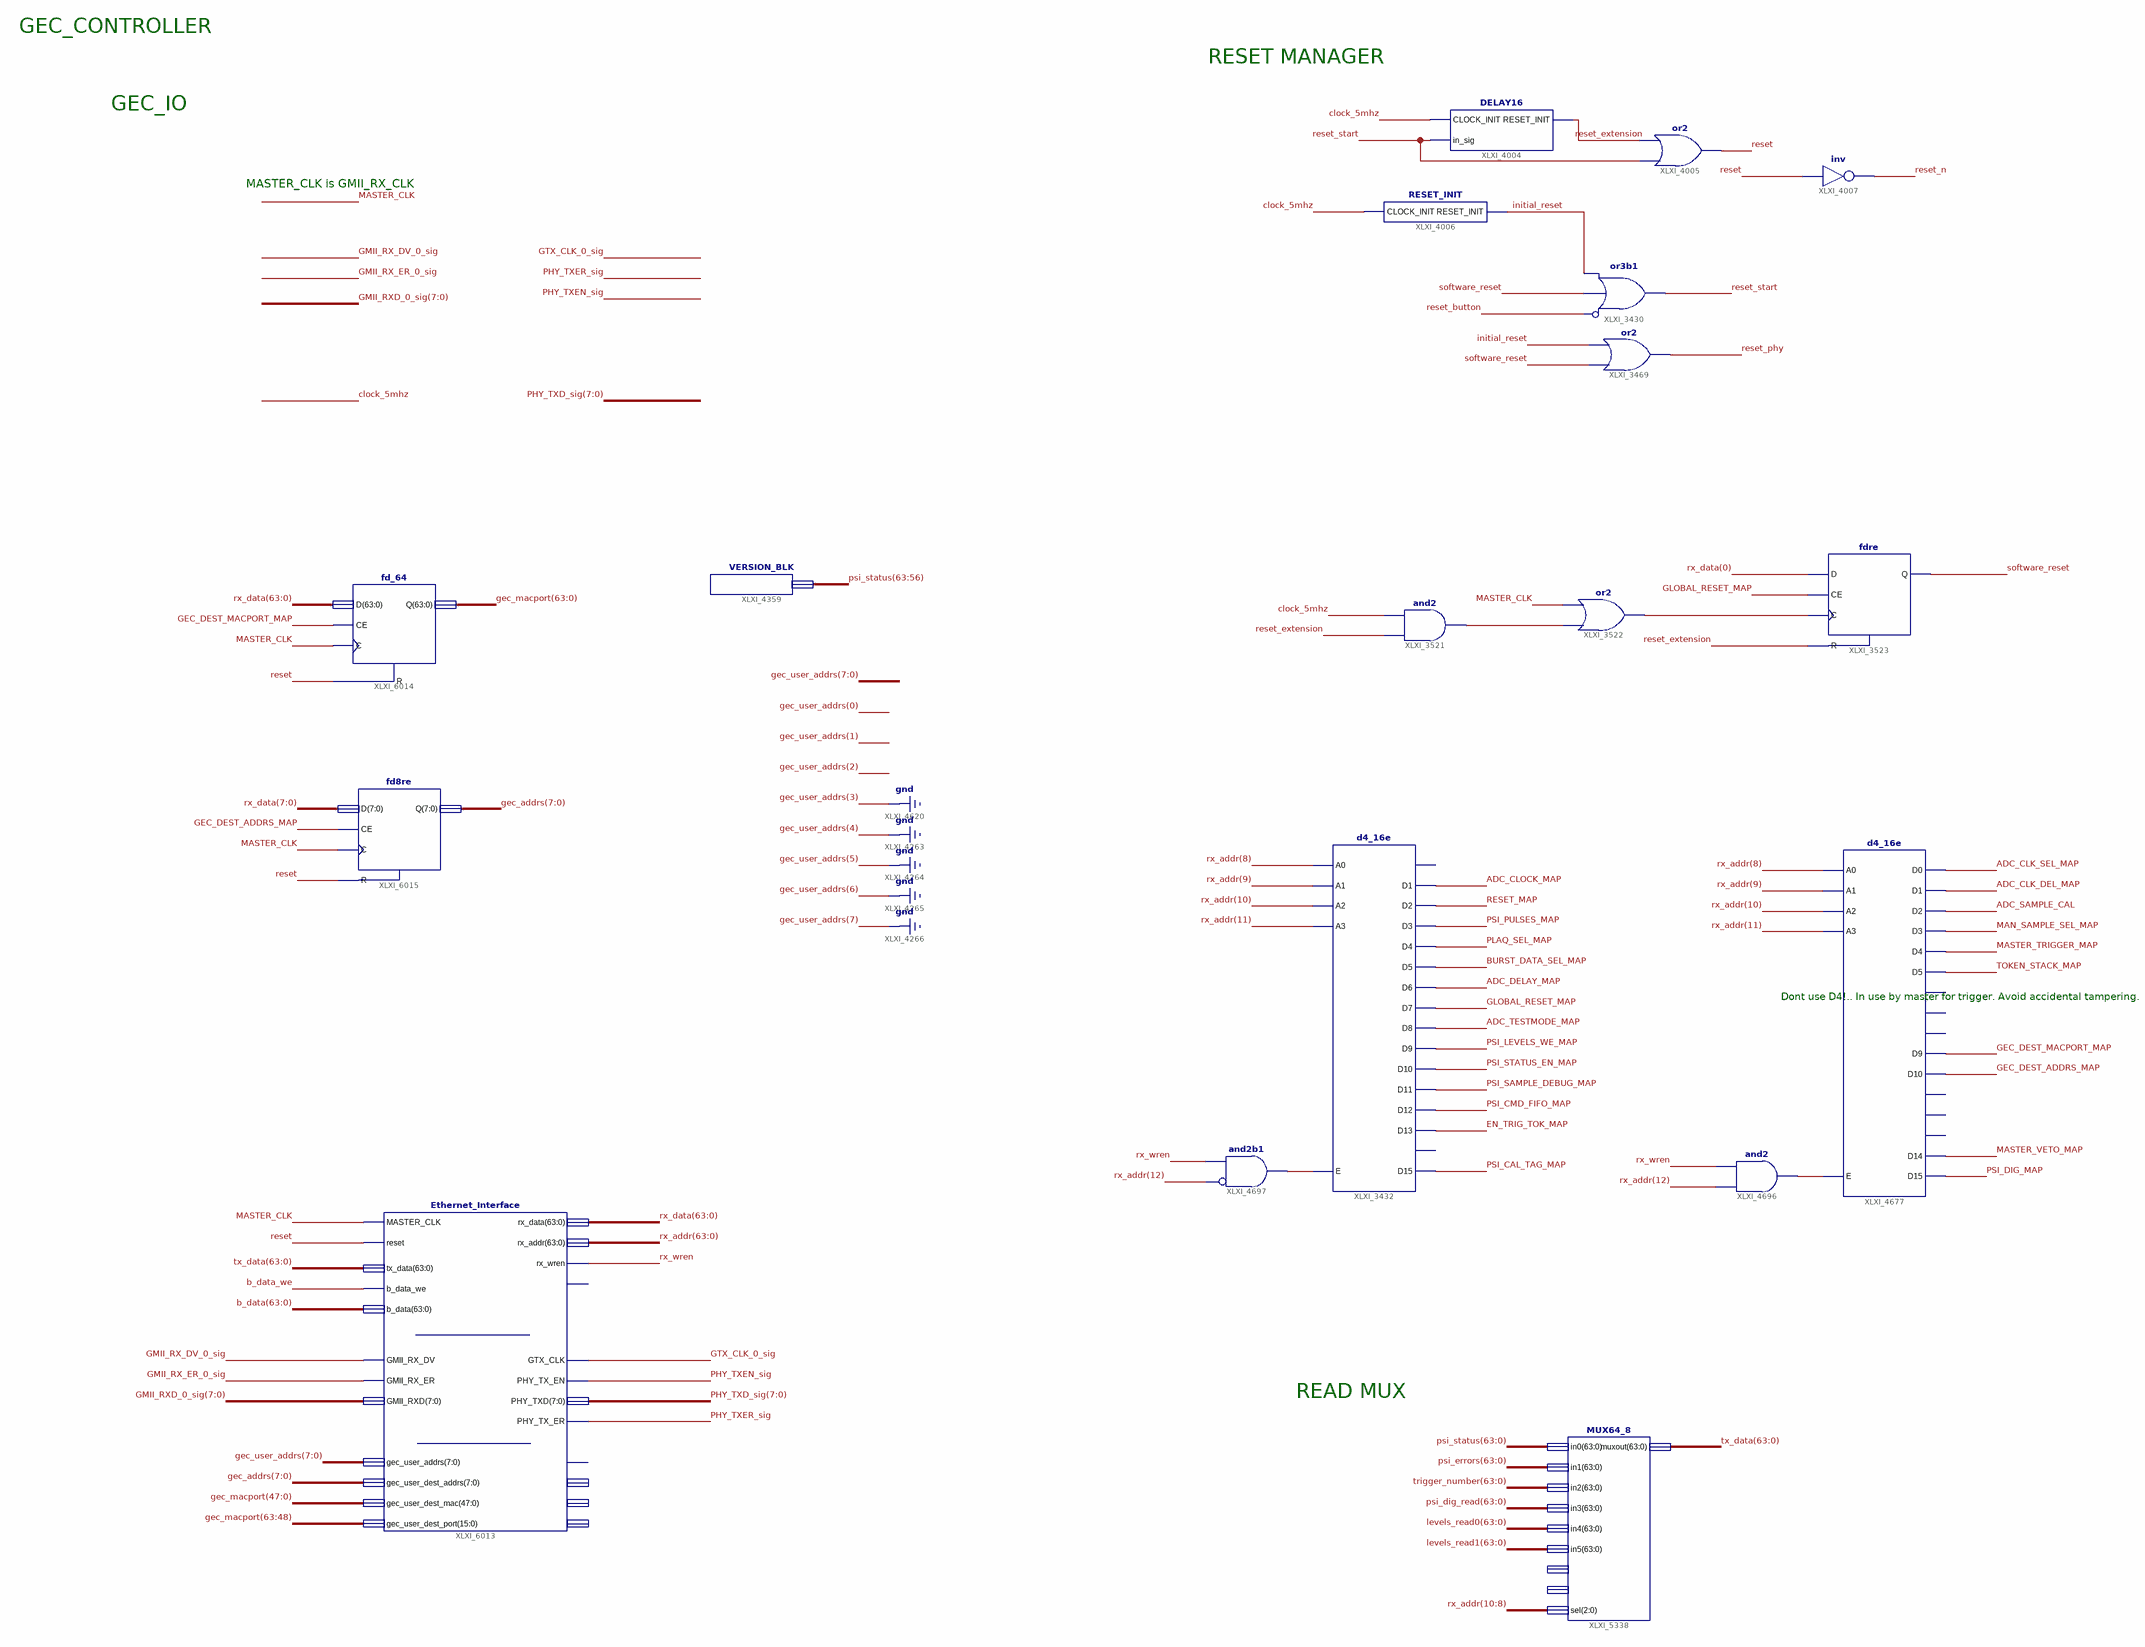
[diagram p0: schematic sheet 1]
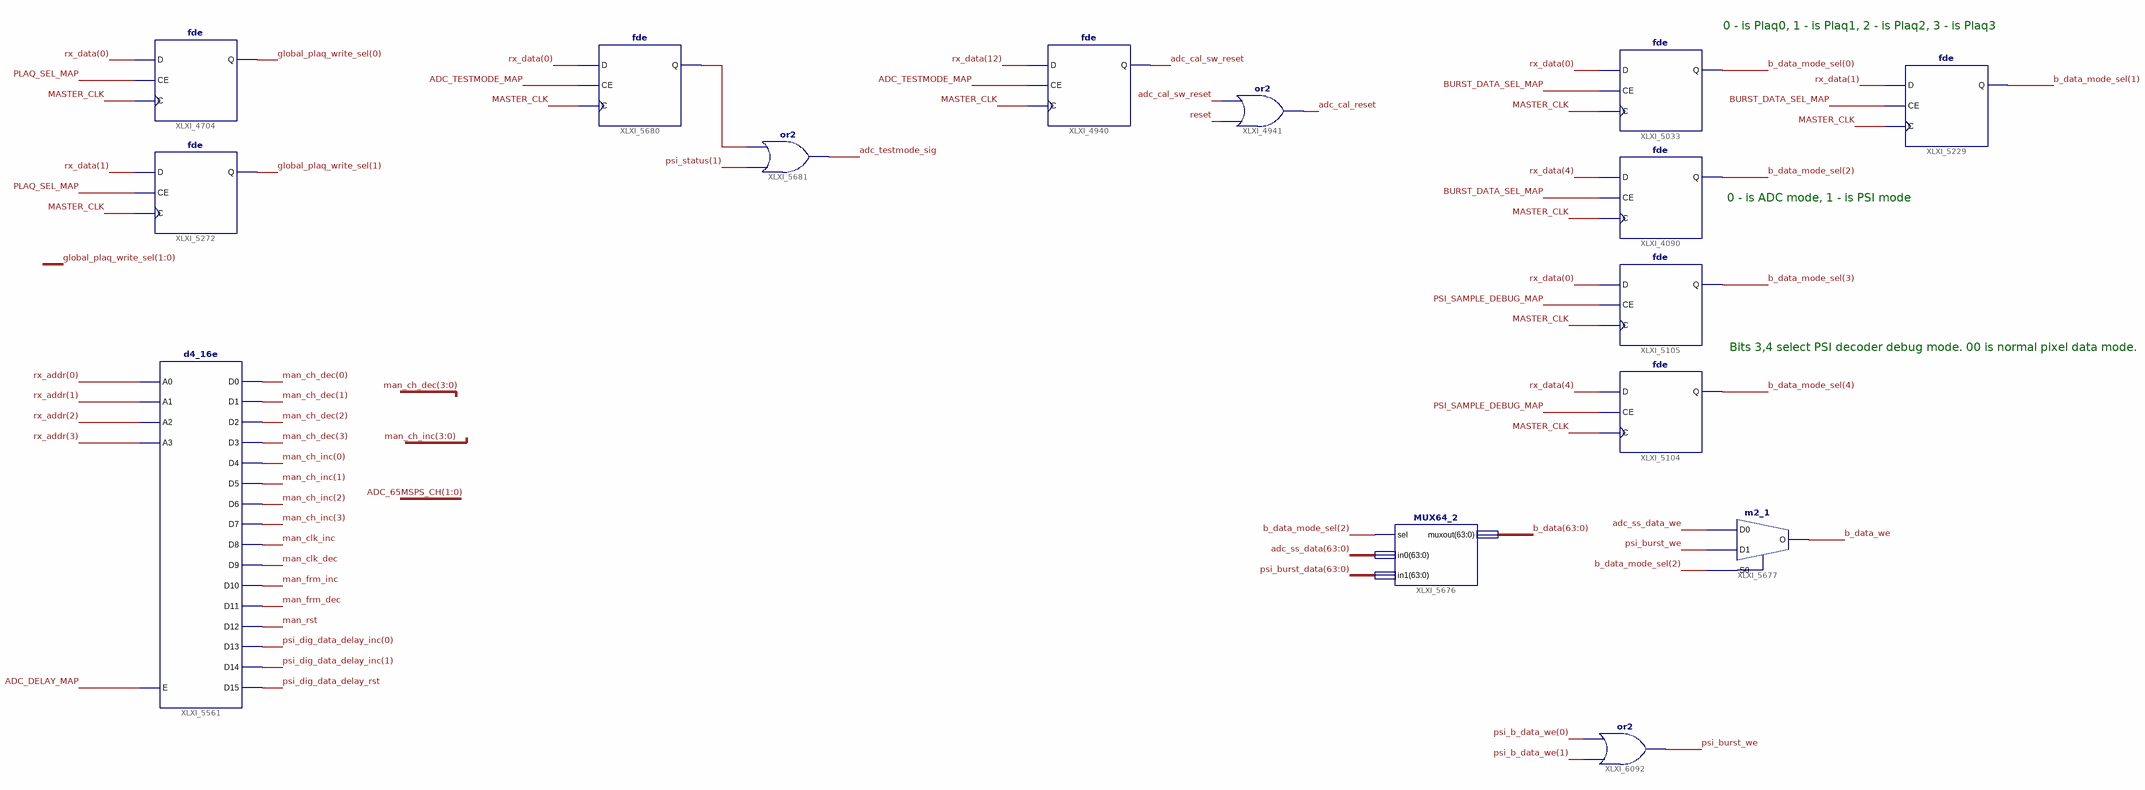
[diagram p1: schematic sheet 2]
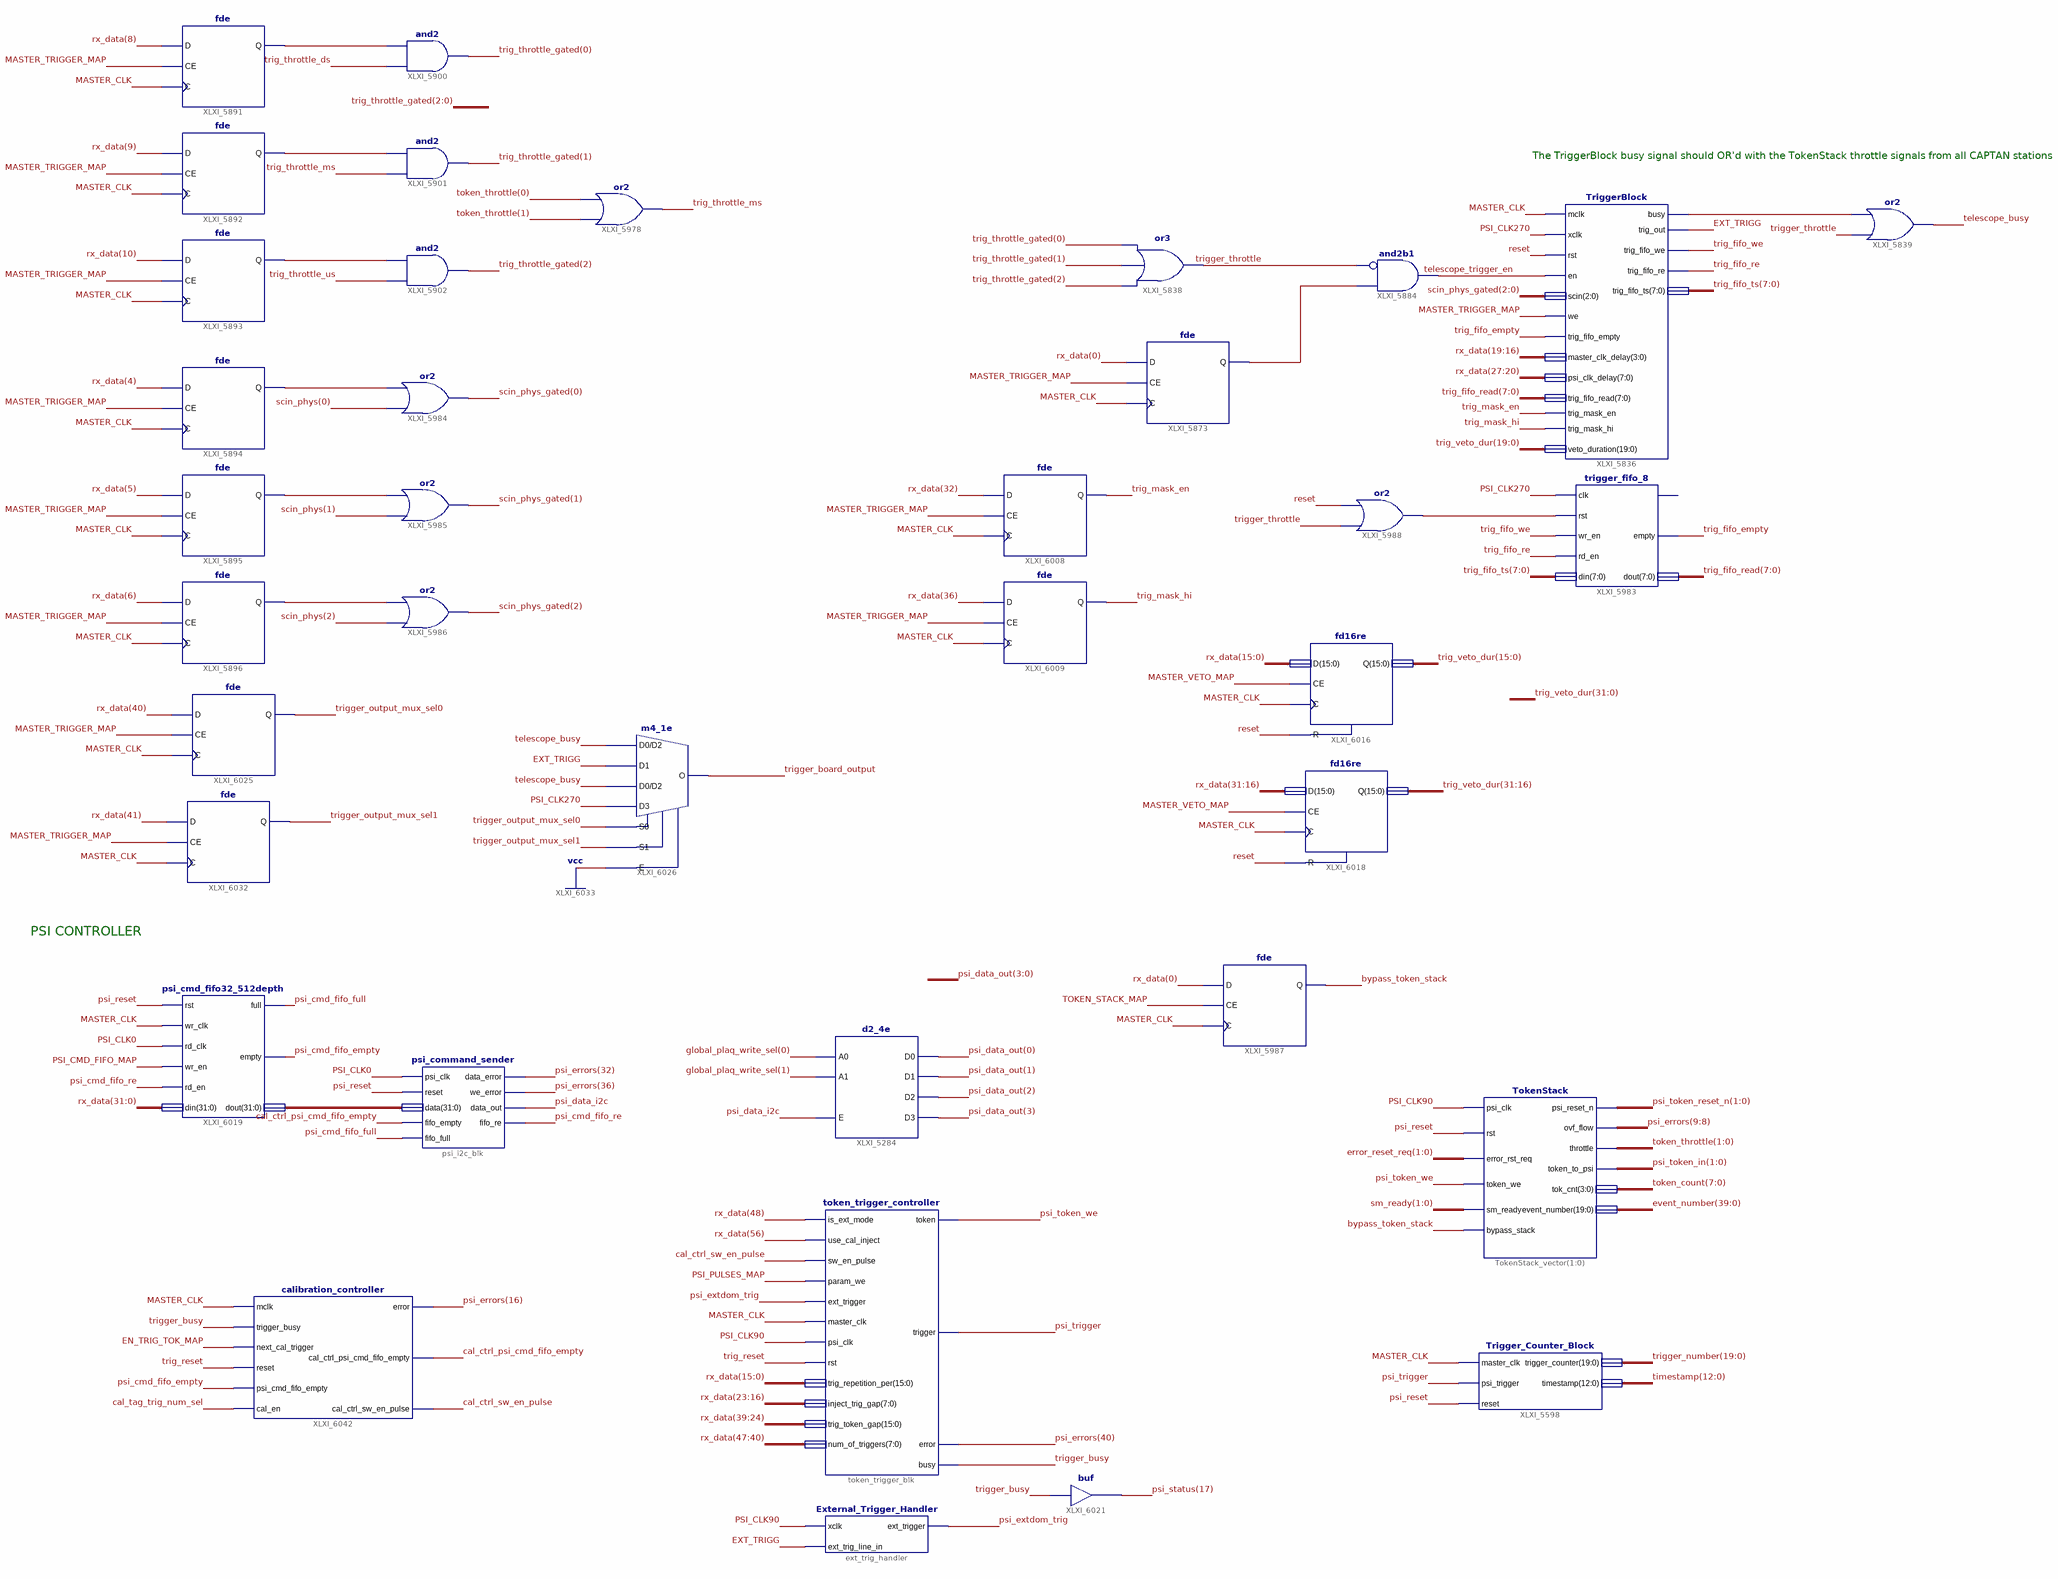
[diagram p2: schematic sheet 3]
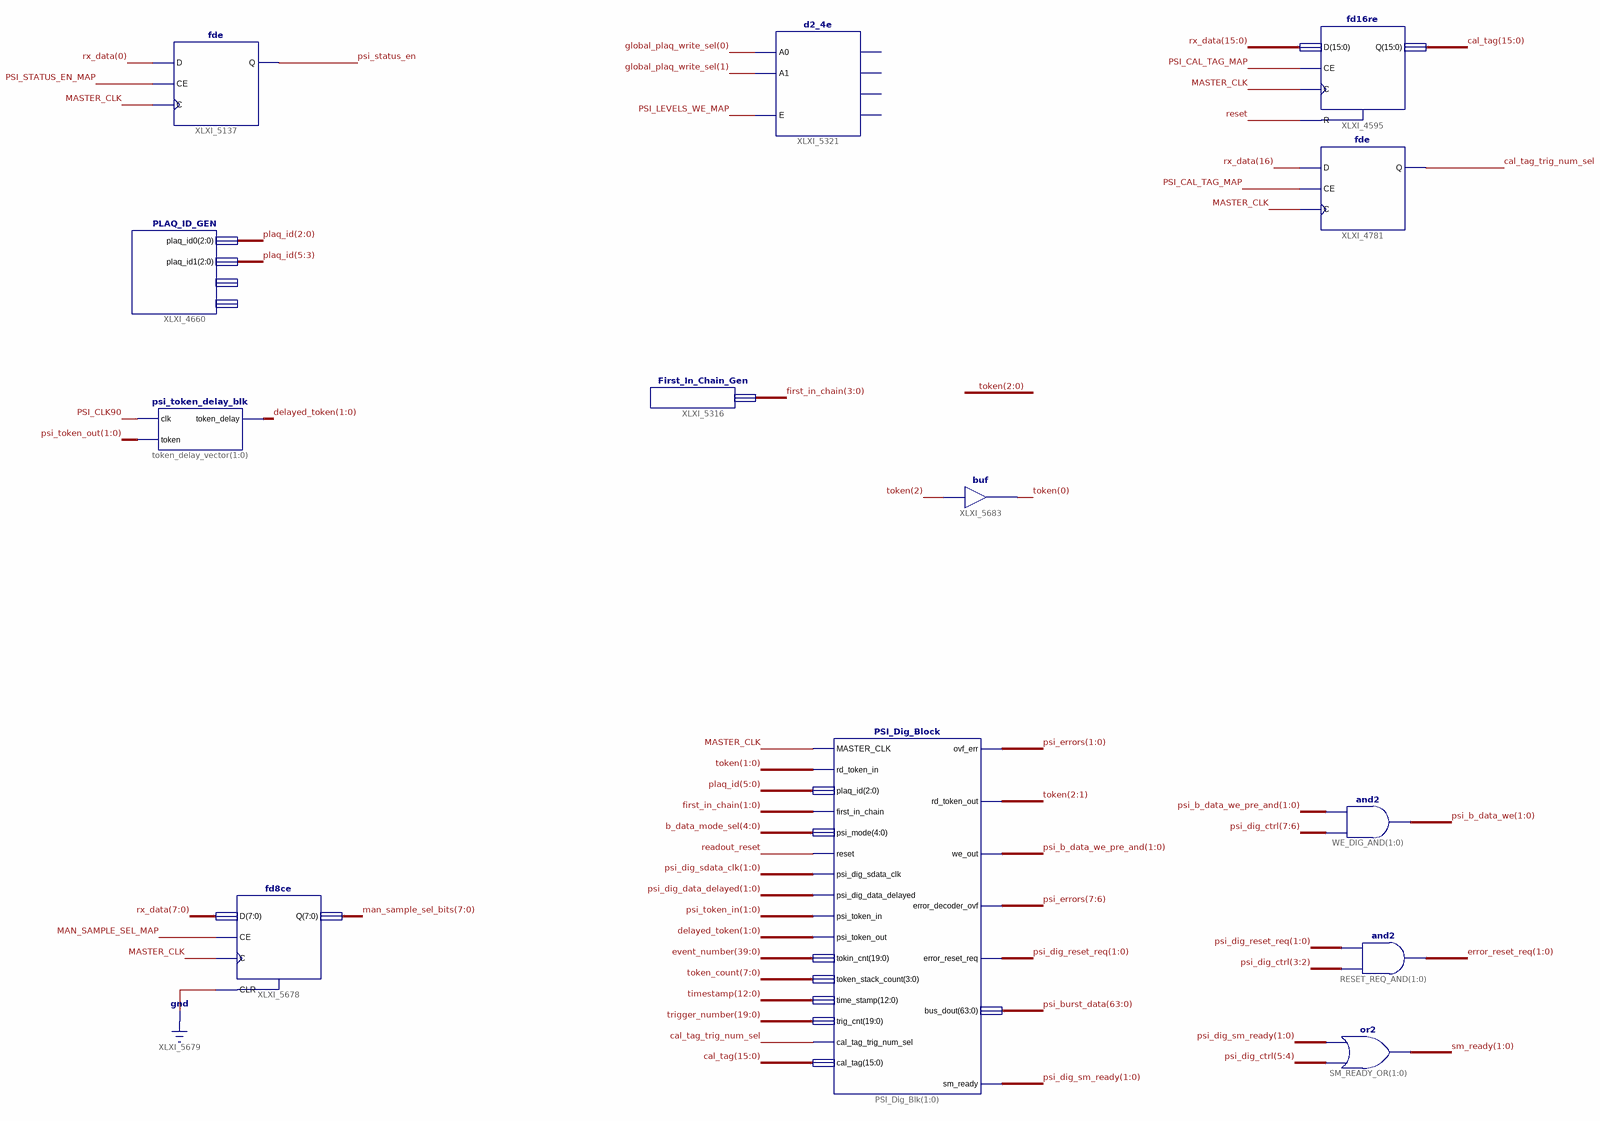
[diagram p3: schematic sheet 4]
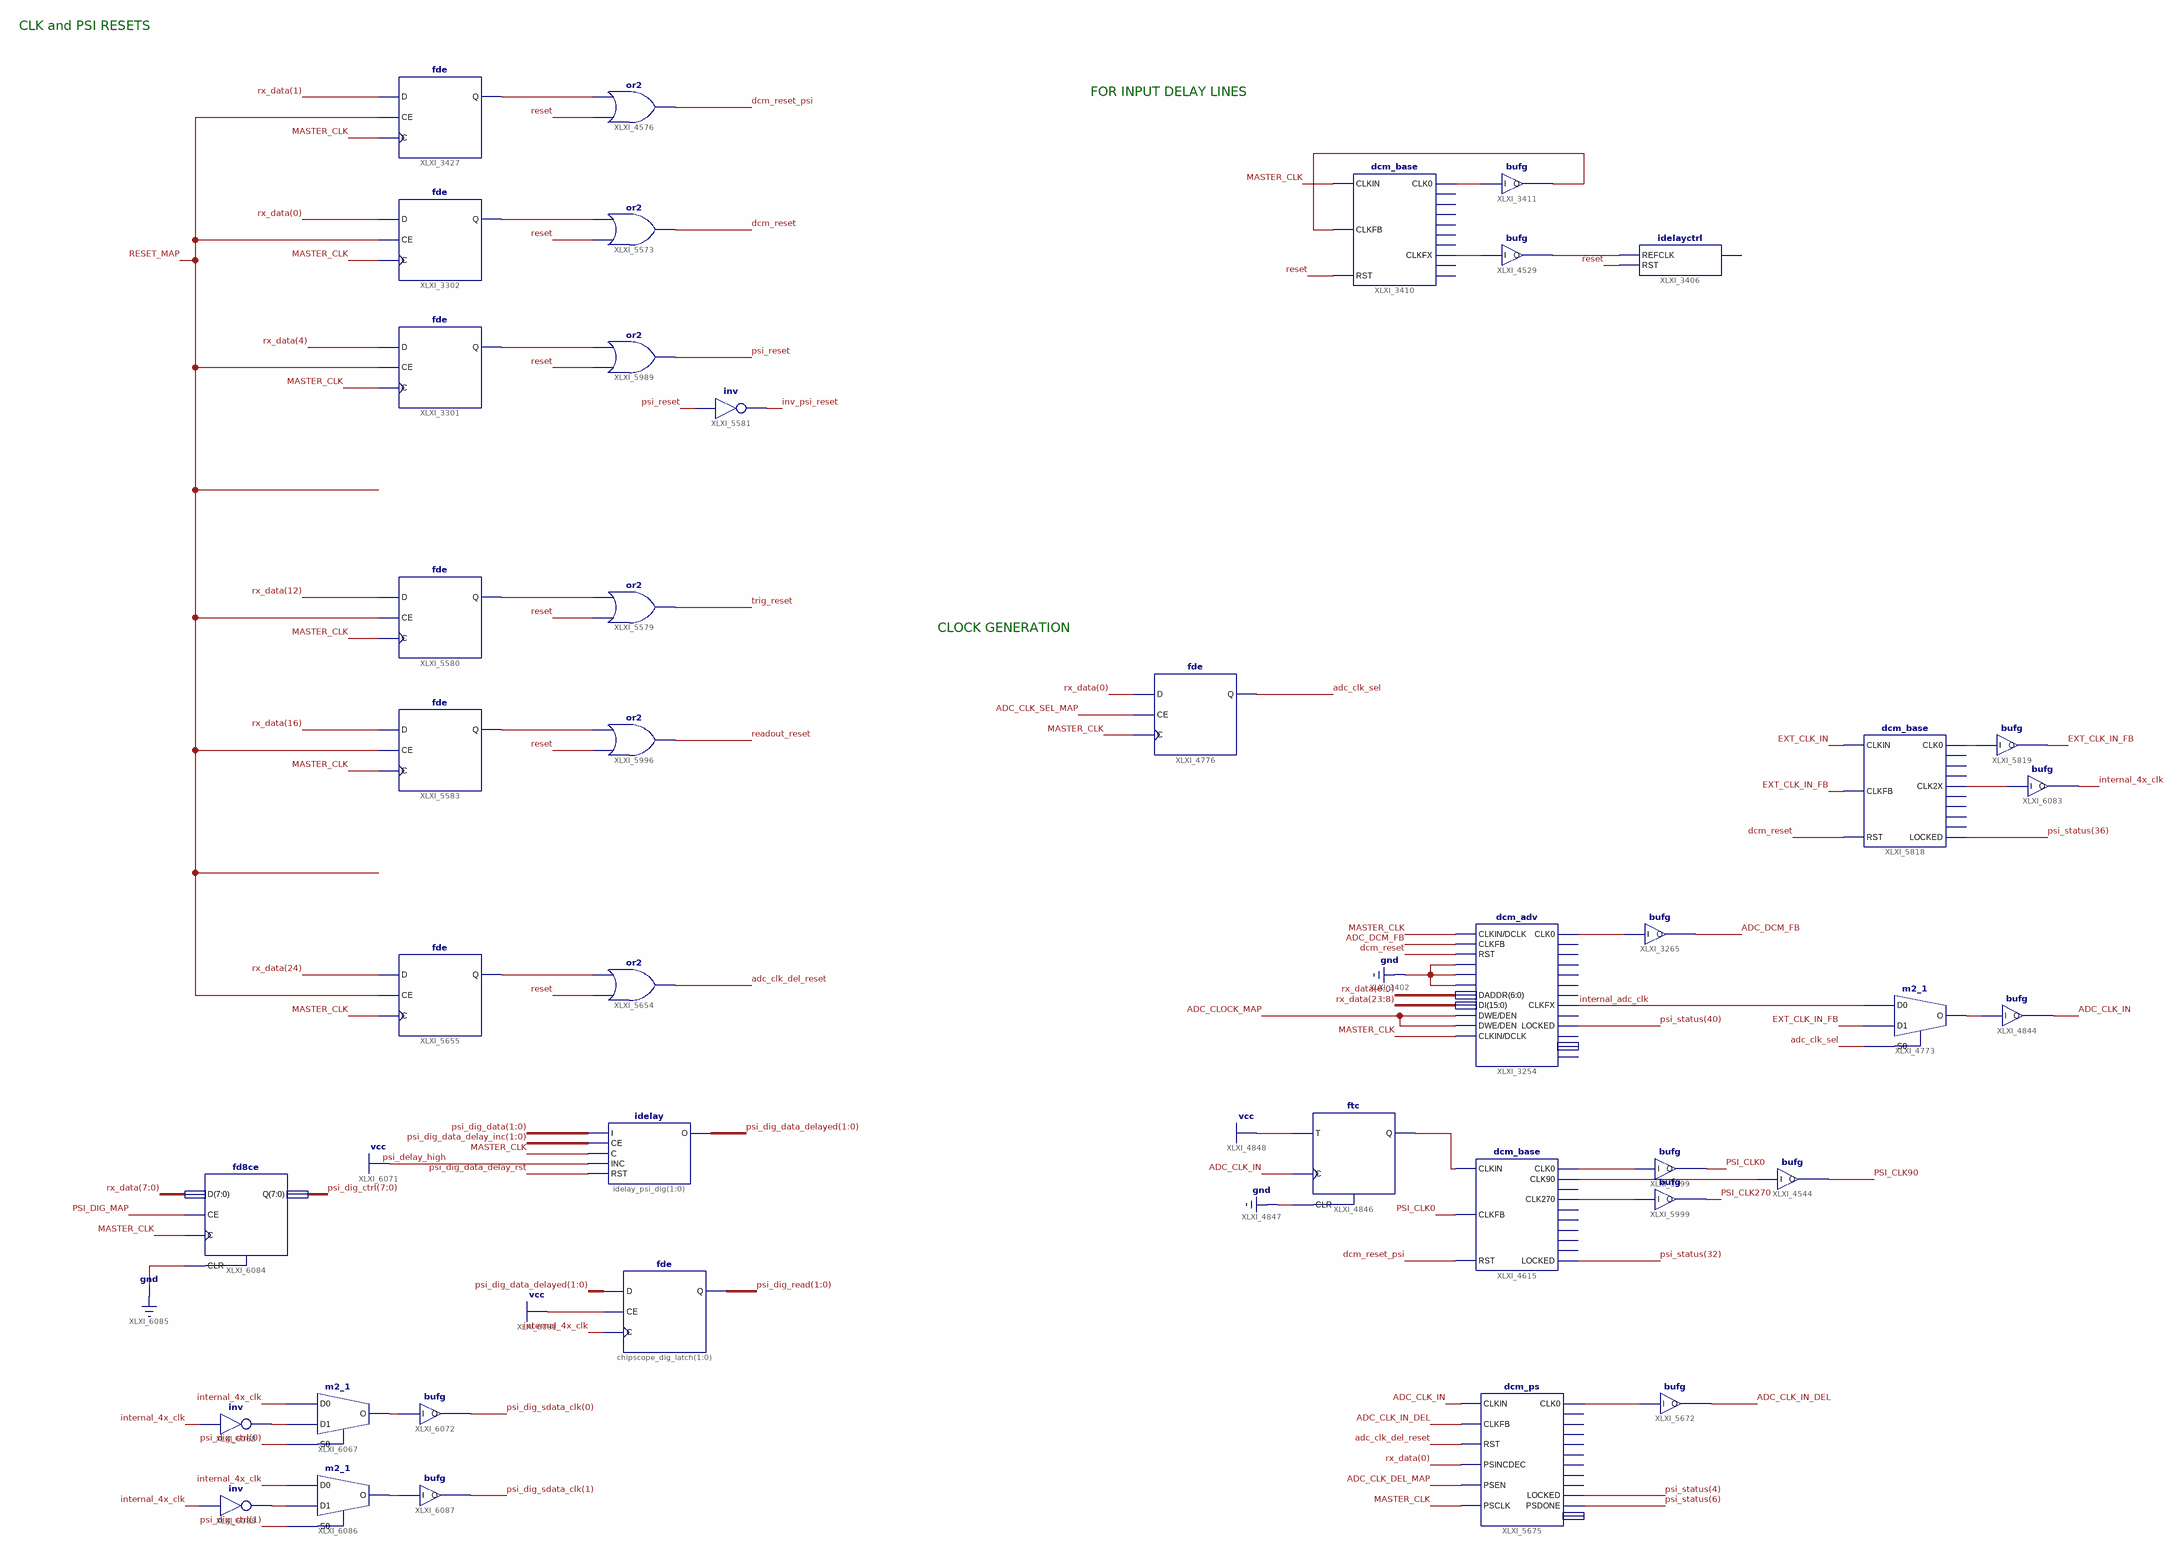
[diagram p4: schematic sheet 5]
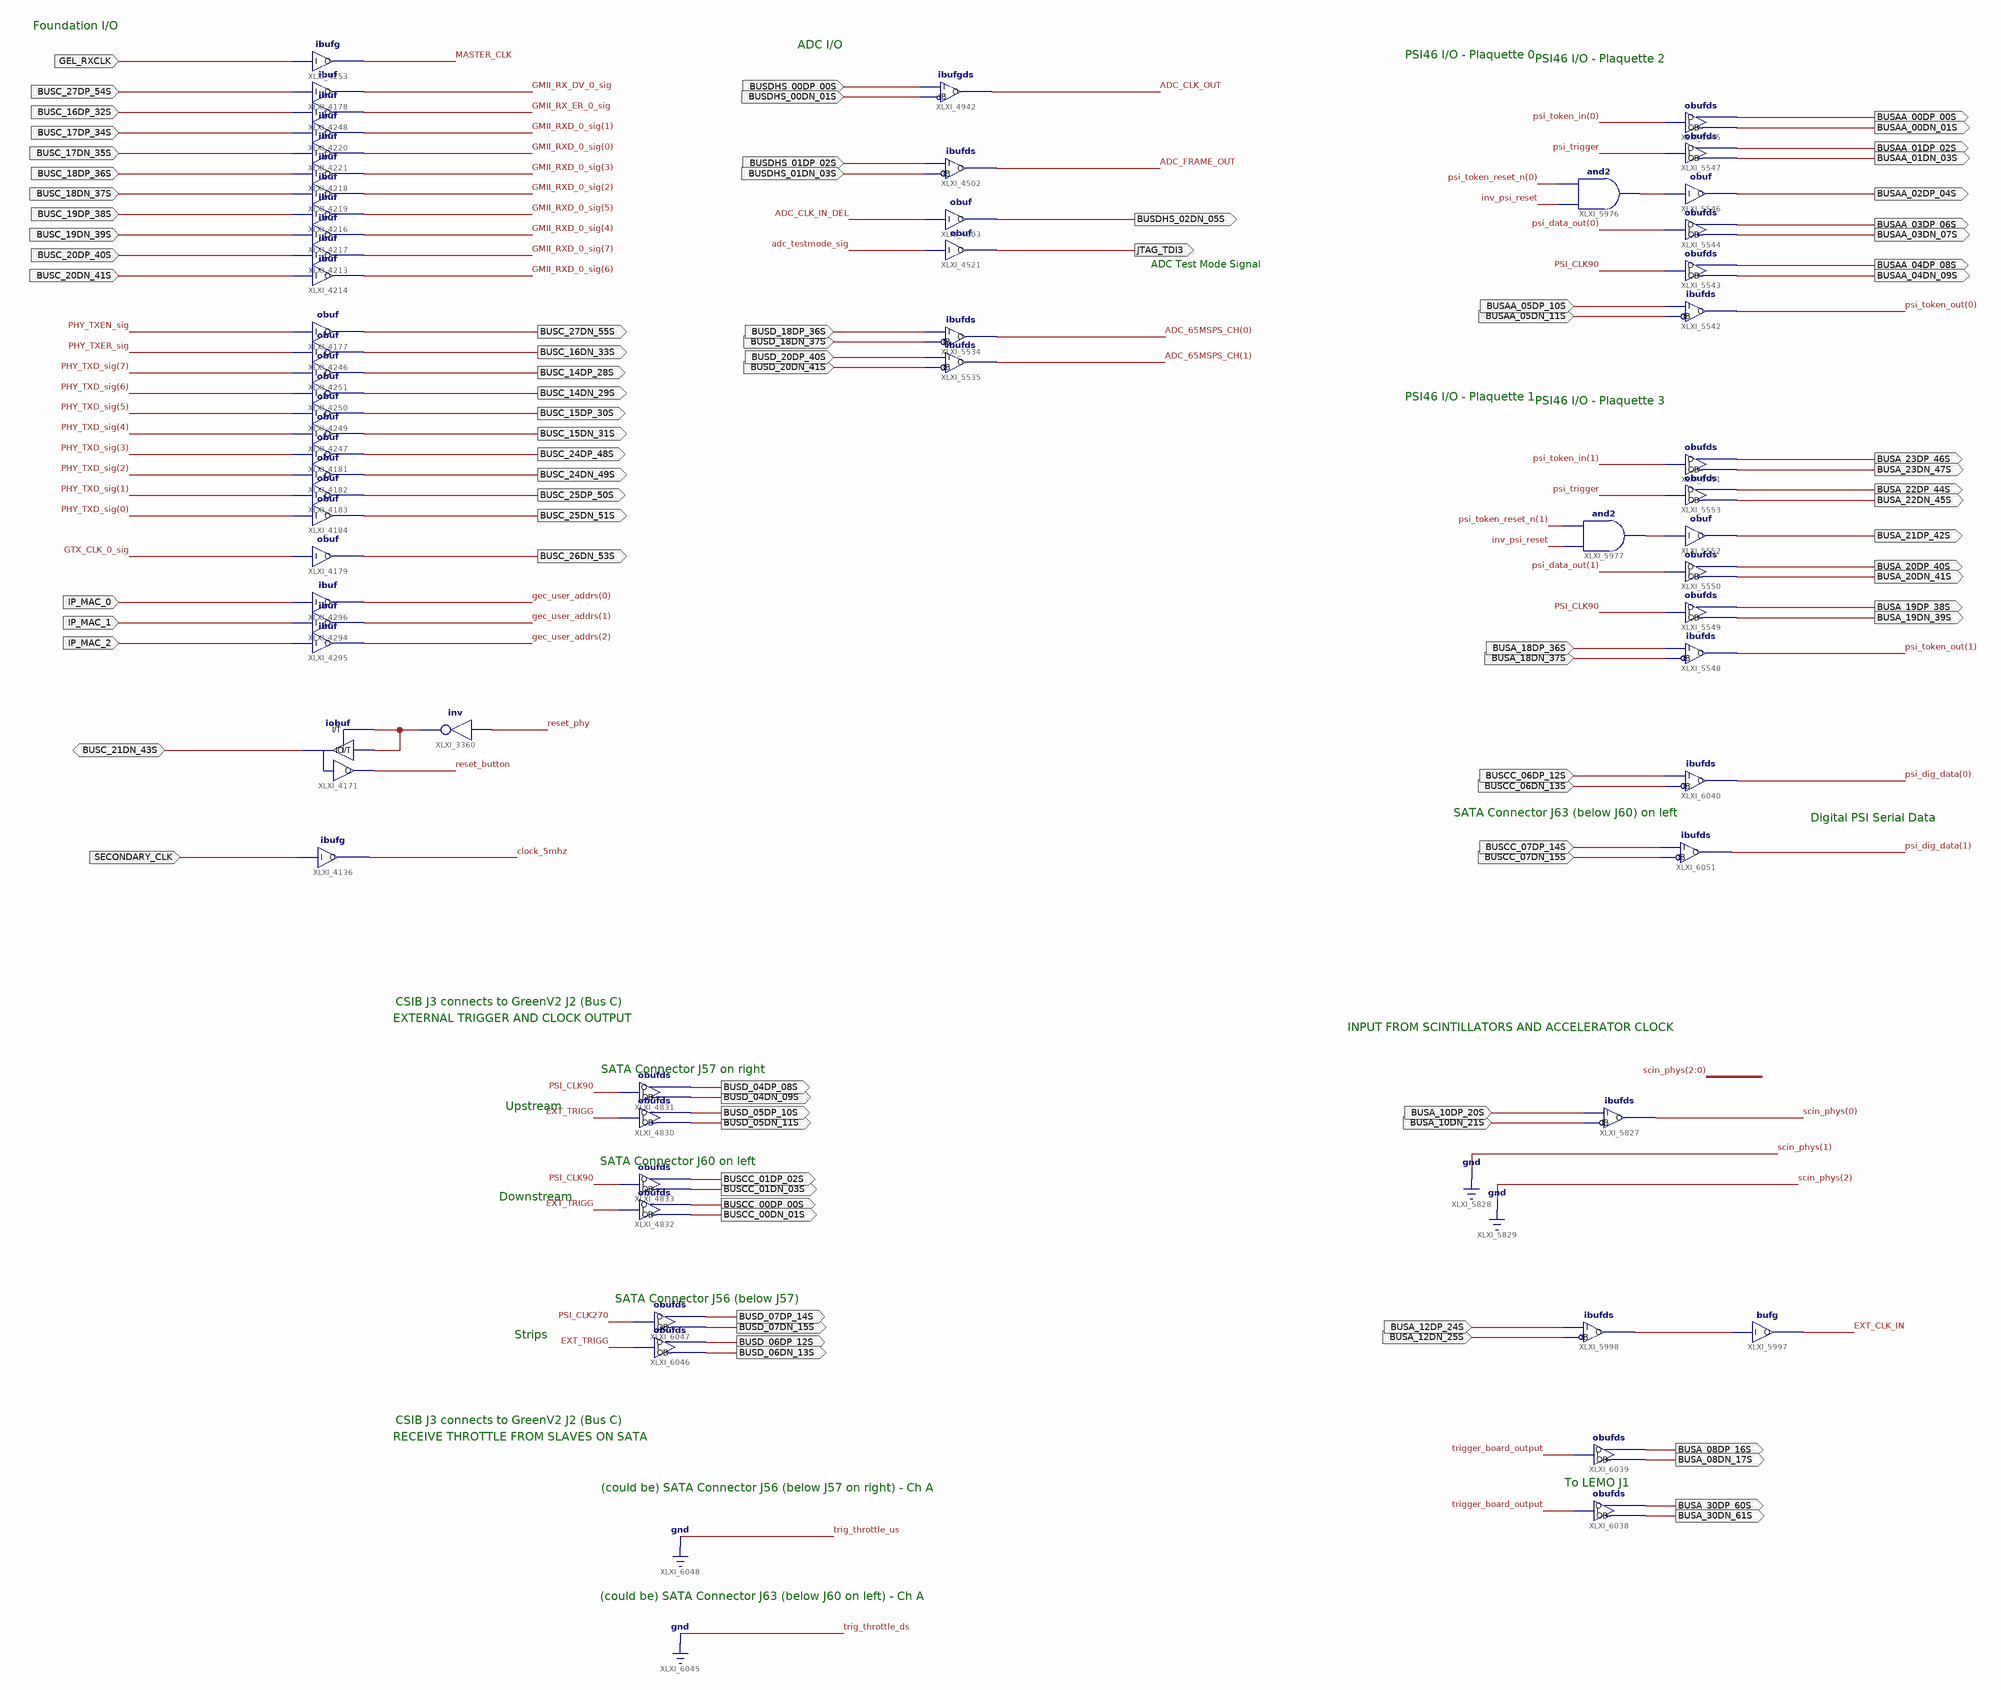
[diagram p5: schematic sheet 6]
// Xilinx ISE schematic TOP_LEVEL.sch (virtex4) as structural Verilog: 185 symbols, 83 ports
module TOP_LEVEL (
  input  BUSC_16DP_32S,
  input  SECONDARY_CLK,
  input  BUSC_20DN_41S,
  input  BUSC_19DN_39S,
  input  BUSC_20DP_40S,
  input  BUSC_19DP_38S,
  input  BUSC_18DP_36S,
  input  BUSC_18DN_37S,
  input  BUSC_17DN_35S,
  input  BUSC_17DP_34S,
  input  BUSC_27DP_54S,
  input  GEL_RXCLK,
  input  IP_MAC_2,
  input  IP_MAC_0,
  input  IP_MAC_1,
  input  BUSDHS_00DP_00S,
  input  BUSDHS_00DN_01S,
  input  BUSDHS_01DP_02S,
  input  BUSDHS_01DN_03S,
  input  BUSD_18DN_37S,
  input  BUSD_18DP_36S,
  input  BUSD_20DN_41S,
  input  BUSD_20DP_40S,
  input  BUSAA_05DP_10S,
  input  BUSAA_05DN_11S,
  input  BUSA_18DP_36S,
  input  BUSA_18DN_37S,
  input  BUSA_12DP_24S,
  input  BUSA_12DN_25S,
  input  BUSA_10DP_20S,
  input  BUSA_10DN_21S,
  input  BUSCC_07DN_15S,
  input  BUSCC_07DP_14S,
  input  BUSCC_06DP_12S,
  input  BUSCC_06DN_13S,
  inout  BUSC_21DN_43S,
  output BUSC_25DN_51S,
  output BUSC_25DP_50S,
  output BUSC_24DN_49S,
  output BUSC_24DP_48S,
  output BUSC_15DN_31S,
  output BUSC_15DP_30S,
  output BUSC_14DN_29S,
  output BUSC_14DP_28S,
  output BUSC_16DN_33S,
  output BUSC_27DN_55S,
  output BUSC_26DN_53S,
  output BUSDHS_02DN_05S,
  output JTAG_TDI3,
  output BUSAA_04DP_08S,
  output BUSAA_04DN_09S,
  output BUSAA_03DP_06S,
  output BUSAA_03DN_07S,
  output BUSAA_00DP_00S,
  output BUSAA_00DN_01S,
  output BUSAA_02DP_04S,
  output BUSAA_01DP_02S,
  output BUSAA_01DN_03S,
  output BUSA_19DP_38S,
  output BUSA_19DN_39S,
  output BUSA_20DP_40S,
  output BUSA_20DN_41S,
  output BUSA_23DP_46S,
  output BUSA_23DN_47S,
  output BUSA_21DP_42S,
  output BUSA_22DP_44S,
  output BUSA_22DN_45S,
  output BUSD_04DN_09S,
  output BUSD_04DP_08S,
  output BUSCC_00DP_00S,
  output BUSCC_00DN_01S,
  output BUSD_05DN_11S,
  output BUSD_05DP_10S,
  output BUSCC_01DN_03S,
  output BUSCC_01DP_02S,
  output BUSA_08DP_16S,
  output BUSA_30DP_60S,
  output BUSA_30DN_61S,
  output BUSA_08DN_17S,
  output BUSD_07DP_14S,
  output BUSD_07DN_15S,
  output BUSD_06DN_13S,
  output BUSD_06DP_12S
);

  wire adc_cal_reset, adc_cal_sw_reset, ADC_CLK_DEL_MAP, adc_clk_del_reset, ADC_CLK_IN, ADC_CLK_IN_DEL,
       ADC_CLK_OUT, adc_clk_sel, ADC_CLK_SEL_MAP, ADC_CLOCK_MAP, ADC_DCM_FB, ADC_DELAY_MAP, ADC_FRAME_OUT,
       ADC_SAMPLE_CAL, adc_ss_data_we, ADC_TESTMODE_MAP, adc_testmode_sig, b_data_we, BURST_DATA_SEL_MAP,
       bypass_token_stack, cal_ctrl_psi_cmd_fifo_empty, cal_ctrl_sw_en_pulse, cal_tag_trig_num_sel,
       clock_5mhz, dcm_reset, dcm_reset_psi, EN_TRIG_TOK_MAP, EXT_CLK_IN, EXT_CLK_IN_FB, EXT_TRIGG,
       GEC_DEST_ADDRS_MAP, GEC_DEST_MACPORT_MAP, GLOBAL_RESET_MAP, GMII_RX_DV_0_sig, GMII_RX_ER_0_sig,
       GTX_CLK_0_sig, initial_reset, internal_4x_clk, internal_adc_clk, inv_psi_reset, man_clk_dec,
       man_clk_inc, man_frm_dec, man_frm_inc, man_rst, MAN_SAMPLE_SEL_MAP, MASTER_CLK, MASTER_TRIGGER_MAP,
       MASTER_VETO_MAP, PHY_TXEN_sig, PHY_TXER_sig, PLAQ_SEL_MAP, psi_burst_we, PSI_CAL_TAG_MAP, PSI_CLK0,
       PSI_CLK90, PSI_CLK270, psi_cmd_fifo_empty, psi_cmd_fifo_full, PSI_CMD_FIFO_MAP, psi_cmd_fifo_re,
       psi_data_i2c, psi_dig_data_delay_rst, PSI_DIG_MAP, psi_extdom_trig, PSI_LEVELS_WE_MAP, PSI_PULSES_MAP,
       psi_reset, PSI_SAMPLE_DEBUG_MAP, psi_status_en, PSI_STATUS_EN_MAP, psi_token_we, psi_trigger,
       readout_reset, reset, reset_button, reset_extension, RESET_MAP, reset_n, reset_phy, reset_start,
       rx_wren, software_reset, telescope_busy, telescope_trigger_en, TOKEN_STACK_MAP, trig_fifo_empty,
       trig_fifo_re, trig_fifo_we, trig_mask_en, trig_mask_hi, trig_reset, trig_throttle_ms,
       trigger_board_output, trigger_busy, trigger_output_mux_sel0, trigger_output_mux_sel1,
       trigger_throttle, XLXN_11574, XLXN_12023, XLXN_12172, XLXN_12220, XLXN_12229, XLXN_12257, XLXN_12498,
       XLXN_12503, XLXN_12617, XLXN_15064, XLXN_15111, XLXN_15755, XLXN_15843, XLXN_15849, XLXN_17193,
       XLXN_17196, XLXN_17199, XLXN_17233, XLXN_17239, XLXN_17430, XLXN_17510, XLXN_17527, XLXN_17712,
       XLXN_17722, XLXN_17849, XLXN_17913, XLXN_17914, XLXN_17915, XLXN_17999, XLXN_18000, XLXN_18001,
       XLXN_18123, XLXN_18124, XLXN_18128, XLXN_18141, XLXN_18142, XLXN_18354, XLXN_18355, XLXN_18356,
       XLXN_18372, XLXN_18373;
  wire [0:0] scin_phys;
  wire [1:0] ADC_65MSPS_CH, delayed_token, error_reset_req, global_plaq_write_sel, psi_b_data_we,
       psi_b_data_we_pre_and, psi_dig_data, psi_dig_data_delay_inc, psi_dig_data_delayed, psi_dig_reset_req,
       psi_dig_sdata_clk, psi_dig_sm_ready, psi_token_in, psi_token_out, psi_token_reset_n, sm_ready,
       token_throttle;
  wire [2:0] gec_user_addrs, scin_phys_gated, token, trig_throttle_gated;
  wire [3:0] first_in_chain, man_ch_dec, man_ch_inc, psi_data_out;
  wire [4:0] b_data_mode_sel;
  wire [5:0] plaq_id;
  wire [7:0] gec_addrs, GMII_RXD_0_sig, man_sample_sel_bits, PHY_TXD_sig, psi_dig_ctrl, token_count,
       trig_fifo_read, trig_fifo_ts;
  wire [12:0] timestamp;
  wire [15:0] cal_tag;
  wire [31:0] trig_veto_dur, XLXN_16082;
  wire [39:0] event_number;
  wire [63:0] adc_ss_data, b_data, gec_macport, levels_read0, levels_read1, psi_burst_data, psi_dig_read,
       psi_errors, psi_status, rx_addr, rx_data, trigger_number, tx_data;

  iobuf XLXI_4171 (.I(XLXN_12023), .IO(BUSC_21DN_43S), .O(reset_button), .T(XLXN_12023));
  not XLXI_3360 (XLXN_12023, reset_phy);
  ibuf XLXI_4248 (.I(BUSC_16DP_32S), .O(GMII_RX_ER_0_sig));
  ibufg XLXI_4136 (.I(SECONDARY_CLK), .O(clock_5mhz));
  obuf XLXI_4181 (.I(PHY_TXD_sig[3]), .O(BUSC_24DP_48S));
  obuf XLXI_4182 (.I(PHY_TXD_sig[2]), .O(BUSC_24DN_49S));
  obuf XLXI_4183 (.I(PHY_TXD_sig[1]), .O(BUSC_25DP_50S));
  obuf XLXI_4184 (.I(PHY_TXD_sig[0]), .O(BUSC_25DN_51S));
  obuf XLXI_4247 (.I(PHY_TXD_sig[4]), .O(BUSC_15DN_31S));
  obuf XLXI_4249 (.I(PHY_TXD_sig[5]), .O(BUSC_15DP_30S));
  obuf XLXI_4250 (.I(PHY_TXD_sig[6]), .O(BUSC_14DN_29S));
  obuf XLXI_4251 (.I(PHY_TXD_sig[7]), .O(BUSC_14DP_28S));
  obuf XLXI_4246 (.I(PHY_TXER_sig), .O(BUSC_16DN_33S));
  ibuf XLXI_4213 (.I(BUSC_20DP_40S), .O(GMII_RXD_0_sig[7]));
  ibuf XLXI_4214 (.I(BUSC_20DN_41S), .O(GMII_RXD_0_sig[6]));
  ibuf XLXI_4216 (.I(BUSC_19DP_38S), .O(GMII_RXD_0_sig[5]));
  ibuf XLXI_4217 (.I(BUSC_19DN_39S), .O(GMII_RXD_0_sig[4]));
  ibuf XLXI_4218 (.I(BUSC_18DP_36S), .O(GMII_RXD_0_sig[3]));
  ibuf XLXI_4219 (.I(BUSC_18DN_37S), .O(GMII_RXD_0_sig[2]));
  ibuf XLXI_4220 (.I(BUSC_17DP_34S), .O(GMII_RXD_0_sig[1]));
  ibuf XLXI_4221 (.I(BUSC_17DN_35S), .O(GMII_RXD_0_sig[0]));
  obuf XLXI_4177 (.I(PHY_TXEN_sig), .O(BUSC_27DN_55S));
  ibuf XLXI_4178 (.I(BUSC_27DP_54S), .O(GMII_RX_DV_0_sig));
  ibufg XLXI_4253 (.I(GEL_RXCLK), .O(MASTER_CLK));
  obuf XLXI_4179 (.I(GTX_CLK_0_sig), .O(BUSC_26DN_53S));
  ibuf XLXI_4294 (.I(IP_MAC_1), .O(gec_user_addrs[1]));
  ibuf XLXI_4295 (.I(IP_MAC_2), .O(gec_user_addrs[2]));
  ibuf XLXI_4296 (.I(IP_MAC_0), .O(gec_user_addrs[0]));
  ibufds #(.DIFF_TERM("TRUE")) XLXI_4502 (.I(BUSDHS_01DP_02S), .IB(BUSDHS_01DN_03S), .O(ADC_FRAME_OUT));
  obuf XLXI_4503 (.I(ADC_CLK_IN_DEL), .O(BUSDHS_02DN_05S));
  RESET_INIT XLXI_4006 (.CLOCK_INIT(clock_5mhz), .RESET_INIT(initial_reset));
  or XLXI_3430 (reset_start, ~reset_button, software_reset, initial_reset);  // or3b1
  or XLXI_3469 (reset_phy, software_reset, initial_reset);
  DELAY16 XLXI_4004 (.CLOCK_INIT(clock_5mhz), .in_sig(reset_start), .RESET_INIT(reset_extension));
  or XLXI_4005 (reset, reset_start, reset_extension);
  fdre XLXI_3523 (.C(XLXN_12498), .CE(GLOBAL_RESET_MAP), .D(rx_data[0]), .R(reset_extension), .Q(software_reset));
  and XLXI_3521 (XLXN_12503, reset_extension, clock_5mhz);
  or XLXI_3522 (XLXN_12498, XLXN_12503, MASTER_CLK);
  d4_16e XLXI_3432 (
    .A0(rx_addr[8]), .A1(rx_addr[9]), .A2(rx_addr[10]), .A3(rx_addr[11]), .E(XLXN_12617), .D1(ADC_CLOCK_MAP),
    .D10(PSI_STATUS_EN_MAP), .D11(PSI_SAMPLE_DEBUG_MAP), .D12(PSI_CMD_FIFO_MAP), .D13(EN_TRIG_TOK_MAP),
    .D15(PSI_CAL_TAG_MAP), .D2(RESET_MAP), .D3(PSI_PULSES_MAP), .D4(PLAQ_SEL_MAP), .D5(BURST_DATA_SEL_MAP),
    .D6(ADC_DELAY_MAP), .D7(GLOBAL_RESET_MAP), .D8(ADC_TESTMODE_MAP), .D9(PSI_LEVELS_WE_MAP));  // open: D0, D14
  and XLXI_4697 (XLXN_12617, ~rx_addr[12], rx_wren);  // and2b1
  fde XLXI_3302 (.C(MASTER_CLK), .CE(RESET_MAP), .D(rx_data[0]), .Q(XLXN_17196));
  fde XLXI_3427 (.C(MASTER_CLK), .CE(RESET_MAP), .D(rx_data[1]), .Q(XLXN_17193));
  fde XLXI_3301 (.C(MASTER_CLK), .CE(RESET_MAP), .D(rx_data[4]), .Q(XLXN_17199));
  fde XLXI_4940 (.C(MASTER_CLK), .CE(ADC_TESTMODE_MAP), .D(rx_data[12]), .Q(adc_cal_sw_reset));
  or XLXI_4941 (adc_cal_reset, reset, adc_cal_sw_reset);
  ibufgds #(.IOSTANDARD("LVDS_25"), .DIFF_TERM("TRUE")) XLXI_4942 (
    .I(BUSDHS_00DP_00S), .IB(BUSDHS_00DN_01S), .O(ADC_CLK_OUT));
  and XLXI_4696 (XLXN_15755, rx_addr[12], rx_wren);
  d4_16e XLXI_4677 (
    .A0(rx_addr[8]), .A1(rx_addr[9]), .A2(rx_addr[10]), .A3(rx_addr[11]), .E(XLXN_15755),
    .D0(ADC_CLK_SEL_MAP), .D1(ADC_CLK_DEL_MAP), .D10(GEC_DEST_ADDRS_MAP), .D14(MASTER_VETO_MAP),
    .D15(PSI_DIG_MAP), .D2(ADC_SAMPLE_CAL), .D3(MAN_SAMPLE_SEL_MAP), .D4(MASTER_TRIGGER_MAP),
    .D5(TOKEN_STACK_MAP), .D9(GEC_DEST_MACPORT_MAP));  // open: D11, D12, D13, D6, D7, D8
  fde XLXI_4090 (.C(MASTER_CLK), .CE(BURST_DATA_SEL_MAP), .D(rx_data[4]), .Q(b_data_mode_sel[2]));
  fde XLXI_5033 (.C(MASTER_CLK), .CE(BURST_DATA_SEL_MAP), .D(rx_data[0]), .Q(b_data_mode_sel[0]));
  fde XLXI_5104 (.C(MASTER_CLK), .CE(PSI_SAMPLE_DEBUG_MAP), .D(rx_data[4]), .Q(b_data_mode_sel[4]));
  fde XLXI_5105 (.C(MASTER_CLK), .CE(PSI_SAMPLE_DEBUG_MAP), .D(rx_data[0]), .Q(b_data_mode_sel[3]));
  not XLXI_4007 (reset_n, reset);
  fde XLXI_5229 (.C(MASTER_CLK), .CE(BURST_DATA_SEL_MAP), .D(rx_data[1]), .Q(b_data_mode_sel[1]));
  fde XLXI_5272 (.C(MASTER_CLK), .CE(PLAQ_SEL_MAP), .D(rx_data[1]), .Q(global_plaq_write_sel[1]));
  fde XLXI_4704 (.C(MASTER_CLK), .CE(PLAQ_SEL_MAP), .D(rx_data[0]), .Q(global_plaq_write_sel[0]));
  d2_4e XLXI_5321 (
    .A0(global_plaq_write_sel[0]), .A1(global_plaq_write_sel[1]), .E(PSI_LEVELS_WE_MAP));  // open: D0, D1, D2, D3
  PLAQ_ID_GEN XLXI_4660 (.plaq_id0(plaq_id[2:0]), .plaq_id1(plaq_id[5:3]));  // open: plaq_id2, plaq_id3
  fde XLXI_5137 (.C(MASTER_CLK), .CE(PSI_STATUS_EN_MAP), .D(rx_data[0]), .Q(psi_status_en));
  psi_token_delay_blk token_delay_vector[1:0] (.clk(PSI_CLK90), .token(psi_token_out), .token_delay(delayed_token));
  First_In_Chain_Gen XLXI_5316 (.first_in_chain(first_in_chain));
  fd16re XLXI_4595 (.C(MASTER_CLK), .CE(PSI_CAL_TAG_MAP), .D(rx_data[15:0]), .R(reset), .Q(cal_tag));
  fde XLXI_4781 (.C(MASTER_CLK), .CE(PSI_CAL_TAG_MAP), .D(rx_data[16]), .Q(cal_tag_trig_num_sel));
  MUX64_8 XLXI_5338 (
    .in0(psi_status), .in1(psi_errors), .in2(trigger_number), .in3(psi_dig_read), .in4(levels_read0),
    .in5(levels_read1), .sel(rx_addr[10:8]), .muxout(tx_data));  // open: in6, in7
  obuf XLXI_4521 (.I(adc_testmode_sig), .O(JTAG_TDI3));
  d4_16e XLXI_5561 (
    .A0(rx_addr[0]), .A1(rx_addr[1]), .A2(rx_addr[2]), .A3(rx_addr[3]), .E(ADC_DELAY_MAP),
    .D0(man_ch_dec[0]), .D1(man_ch_dec[1]), .D10(man_frm_inc), .D11(man_frm_dec), .D12(man_rst),
    .D13(psi_dig_data_delay_inc[0]), .D14(psi_dig_data_delay_inc[1]), .D15(psi_dig_data_delay_rst),
    .D2(man_ch_dec[2]), .D3(man_ch_dec[3]), .D4(man_ch_inc[0]), .D5(man_ch_inc[1]), .D6(man_ch_inc[2]),
    .D7(man_ch_inc[3]), .D8(man_clk_inc), .D9(man_clk_dec));
  psi_command_sender psi_i2c_blk (
    .psi_clk(PSI_CLK0), .reset(psi_reset), .fifo_empty(cal_ctrl_psi_cmd_fifo_empty),
    .fifo_full(psi_cmd_fifo_full), .data(XLXN_16082), .fifo_re(psi_cmd_fifo_re), .data_error(psi_errors[32]),
    .we_error(psi_errors[36]), .data_out(psi_data_i2c));
  d2_4e XLXI_5284 (
    .A0(global_plaq_write_sel[0]), .A1(global_plaq_write_sel[1]), .E(psi_data_i2c), .D0(psi_data_out[0]),
    .D1(psi_data_out[1]), .D2(psi_data_out[2]), .D3(psi_data_out[3]));
  token_trigger_controller token_trigger_blk (
    .is_ext_mode(rx_data[48]), .use_cal_inject(rx_data[56]), .sw_en_pulse(cal_ctrl_sw_en_pulse),
    .param_we(PSI_PULSES_MAP), .ext_trigger(psi_extdom_trig), .master_clk(MASTER_CLK), .psi_clk(PSI_CLK90),
    .rst(trig_reset), .trig_repetition_per(rx_data[15:0]), .inject_trig_gap(rx_data[23:16]),
    .trig_token_gap(rx_data[39:24]), .num_of_triggers(rx_data[47:40]), .token(psi_token_we),
    .trigger(psi_trigger), .error(psi_errors[40]), .busy(trigger_busy));
  ibufds #(.DIFF_TERM("TRUE")) XLXI_5535 (.I(BUSD_20DP_40S), .IB(BUSD_20DN_41S), .O(ADC_65MSPS_CH[1]));
  ibufds #(.DIFF_TERM("TRUE")) XLXI_5534 (.I(BUSD_18DP_36S), .IB(BUSD_18DN_37S), .O(ADC_65MSPS_CH[0]));
  or XLXI_4576 (dcm_reset_psi, reset, XLXN_17193);
  or XLXI_5573 (dcm_reset, reset, XLXN_17196);
  or XLXI_5579 (trig_reset, reset, XLXN_17233);
  fde XLXI_5580 (.C(MASTER_CLK), .CE(RESET_MAP), .D(rx_data[12]), .Q(XLXN_17233));
  not XLXI_5581 (inv_psi_reset, psi_reset);
  fde XLXI_5583 (.C(MASTER_CLK), .CE(RESET_MAP), .D(rx_data[16]), .Q(XLXN_17239));
  or XLXI_5654 (adc_clk_del_reset, reset, XLXN_17430);
  fde XLXI_5655 (.C(MASTER_CLK), .CE(RESET_MAP), .D(rx_data[24]), .Q(XLXN_17430));
  MUX64_2 XLXI_5676 (.sel(b_data_mode_sel[2]), .in0(adc_ss_data), .in1(psi_burst_data), .muxout(b_data));
  m2_1 XLXI_5677 (.D0(adc_ss_data_we), .D1(psi_burst_we), .S0(b_data_mode_sel[2]), .O(b_data_we));
  fd8ce XLXI_5678 (.C(MASTER_CLK), .CE(MAN_SAMPLE_SEL_MAP), .CLR(1'b0), .D(rx_data[7:0]), .Q(man_sample_sel_bits));
  fde XLXI_5680 (.C(MASTER_CLK), .CE(ADC_TESTMODE_MAP), .D(rx_data[0]), .Q(XLXN_17527));
  or XLXI_5681 (adc_testmode_sig, psi_status[1], XLXN_17527);
  dcm_base #(.CLKIN_PERIOD(8), .CLKFX_MULTIPLY(8), .CLKFX_DIVIDE(5)) XLXI_3410 (
    .CLKIN(MASTER_CLK), .CLKFB(XLXN_12229), .RST(reset), .CLK0(XLXN_12220), .CLKFX(XLXN_12257));  // open: CLK90, CLK180, CLK270, CLK2X, CLK2X180, CLKDV, CLKFX180, LOCKED
  bufg XLXI_3411 (.I(XLXN_12220), .O(XLXN_12229));
  idelayctrl XLXI_3406 (.REFCLK(XLXN_15064), .RST(reset));  // open: RDY
  bufg XLXI_4529 (.I(XLXN_12257), .O(XLXN_15064));
  ibufds #(.DIFF_TERM("TRUE")) XLXI_5542 (.I(BUSAA_05DP_10S), .IB(BUSAA_05DN_11S), .O(psi_token_out[0]));
  obufds XLXI_5543 (.I(PSI_CLK90), .O(BUSAA_04DP_08S), .OB(BUSAA_04DN_09S));
  obufds XLXI_5544 (.I(psi_data_out[0]), .O(BUSAA_03DP_06S), .OB(BUSAA_03DN_07S));
  obufds XLXI_5545 (.I(psi_token_in[0]), .O(BUSAA_00DP_00S), .OB(BUSAA_00DN_01S));
  obuf XLXI_5546 (.I(XLXN_18123), .O(BUSAA_02DP_04S));
  obufds XLXI_5547 (.I(psi_trigger), .O(BUSAA_01DP_02S), .OB(BUSAA_01DN_03S));
  ibufds #(.DIFF_TERM("TRUE")) XLXI_5548 (.I(BUSA_18DP_36S), .IB(BUSA_18DN_37S), .O(psi_token_out[1]));
  obufds XLXI_5549 (.I(PSI_CLK90), .O(BUSA_19DP_38S), .OB(BUSA_19DN_39S));
  obufds XLXI_5550 (.I(psi_data_out[1]), .O(BUSA_20DP_40S), .OB(BUSA_20DN_41S));
  obufds XLXI_5551 (.I(psi_token_in[1]), .O(BUSA_23DP_46S), .OB(BUSA_23DN_47S));
  obuf XLXI_5552 (.I(XLXN_18124), .O(BUSA_21DP_42S));
  obufds XLXI_5553 (.I(psi_trigger), .O(BUSA_22DP_44S), .OB(BUSA_22DN_45S));
  fde XLXI_4776 (.C(MASTER_CLK), .CE(ADC_CLK_SEL_MAP), .D(rx_data[0]), .Q(adc_clk_sel));
  bufg XLXI_3265 (.I(XLXN_11574), .O(ADC_DCM_FB));
  dcm_adv #(.CLKFX_MULTIPLY(16), .CLKFX_DIVIDE(27), .DLL_FREQUENCY_MODE("LOW"), .DFS_FREQUENCY_MODE("LOW"), .CLKIN_PERIOD(8), .CLKOUT_PHASE_SHIFT("NONE")) XLXI_3254 (
    .CLKIN(MASTER_CLK), .CLKFB(ADC_DCM_FB), .RST(dcm_reset), .PSINCDEC(1'b0), .PSEN(1'b0), .PSCLK(1'b0),
    .DADDR(rx_data[6:0]), .DI(rx_data[23:8]), .DWE(ADC_CLOCK_MAP), .DEN(ADC_CLOCK_MAP), .DCLK(MASTER_CLK),
    .CLK0(XLXN_11574), .CLKFX(internal_adc_clk), .LOCKED(psi_status[40]));  // open: CLK90, CLK180, CLK270, CLK2X, CLK2X180, CLKDV, CLKFX180, PSDONE, DO, DRDY
  bufg XLXI_3399 (.I(XLXN_12172), .O(PSI_CLK0));
  bufg XLXI_4544 (.I(XLXN_15111), .O(PSI_CLK90));
  dcm_base #(.CLKIN_PERIOD(26), .CLKFX_MULTIPLY(4), .CLKFX_DIVIDE(4), .DCM_PERFORMANCE_MODE("MAX_RANGE"), .CLKIN_DIVIDE_BY_2("FALSE"), .CLK_FEEDBACK("1X")) XLXI_4615 (
    .CLKIN(XLXN_15849), .CLKFB(PSI_CLK0), .RST(dcm_reset_psi), .CLK0(XLXN_12172), .CLK90(XLXN_15111),
    .CLK270(XLXN_18142), .LOCKED(psi_status[32]));  // open: CLK180, CLK2X, CLK2X180, CLKDV, CLKFX, CLKFX180
  dcm_ps XLXI_5675 (
    .CLKIN(ADC_CLK_IN), .CLKFB(ADC_CLK_IN_DEL), .RST(adc_clk_del_reset), .PSINCDEC(rx_data[0]),
    .PSEN(ADC_CLK_DEL_MAP), .PSCLK(MASTER_CLK), .CLK0(XLXN_17510), .LOCKED(psi_status[4]),
    .PSDONE(psi_status[6]));  // open: CLK90, CLK180, CLK270, CLK2X, CLK2X180, CLKDV, CLKFX, CLKFX180, DO
  bufg XLXI_5672 (.I(XLXN_17510), .O(ADC_CLK_IN_DEL));
  dcm_base #(.CLKIN_PERIOD(18), .CLKFX_MULTIPLY(4), .CLKFX_DIVIDE(4), .DCM_PERFORMANCE_MODE("MAX_SPEED"), .CLKIN_DIVIDE_BY_2("FALSE"), .CLK_FEEDBACK("1X")) XLXI_5818 (
    .CLKIN(EXT_CLK_IN), .CLKFB(EXT_CLK_IN_FB), .RST(dcm_reset), .CLK0(XLXN_17712), .CLK2X(XLXN_18354),
    .LOCKED(psi_status[36]));  // open: CLK90, CLK180, CLK270, CLK2X180, CLKDV, CLKFX, CLKFX180
  bufg XLXI_5819 (.I(XLXN_17712), .O(EXT_CLK_IN_FB));
  m2_1 XLXI_4773 (.D0(internal_adc_clk), .D1(EXT_CLK_IN_FB), .S0(adc_clk_sel), .O(XLXN_15843));
  bufg XLXI_4844 (.I(XLXN_15843), .O(ADC_CLK_IN));
  obufds XLXI_4831 (.I(PSI_CLK90), .O(BUSD_04DP_08S), .OB(BUSD_04DN_09S));
  obufds XLXI_4832 (.I(EXT_TRIGG), .O(BUSCC_00DP_00S), .OB(BUSCC_00DN_01S));
  obufds XLXI_4830 (.I(EXT_TRIGG), .O(BUSD_05DP_10S), .OB(BUSD_05DN_11S));
  obufds XLXI_4833 (.I(PSI_CLK90), .O(BUSCC_01DP_02S), .OB(BUSCC_01DN_03S));
  External_Trigger_Handler ext_trig_handler (
    .xclk(PSI_CLK90), .ext_trig_line_in(EXT_TRIGG), .ext_trigger(psi_extdom_trig));
  TokenStack TokenStack_vector[1:0] (
    .psi_clk(PSI_CLK90), .rst(psi_reset), .error_rst_req(error_reset_req), .token_we(psi_token_we),
    .sm_ready(sm_ready), .bypass_stack(bypass_token_stack), .psi_reset_n(psi_token_reset_n),
    .ovf_flow(psi_errors[9:8]), .throttle(token_throttle), .token_to_psi(psi_token_in),
    .tok_cnt(token_count), .event_number(event_number));
  Trigger_Counter_Block XLXI_5598 (
    .master_clk(MASTER_CLK), .psi_trigger(psi_trigger), .reset(psi_reset),
    .trigger_counter(trigger_number[19:0]), .timestamp(timestamp));
  and XLXI_5977 (XLXN_18124, inv_psi_reset, psi_token_reset_n[1]);
  and XLXI_5976 (XLXN_18123, inv_psi_reset, psi_token_reset_n[0]);
  ibufds #(.DIFF_TERM("TRUE")) XLXI_5827 (.I(BUSA_10DP_20S), .IB(BUSA_10DN_21S), .O(scin_phys[0]));
  fde XLXI_5987 (.C(MASTER_CLK), .CE(TOKEN_STACK_MAP), .D(rx_data[0]), .Q(bypass_token_stack));
  or XLXI_5989 (psi_reset, reset, XLXN_17199);
  or XLXI_5996 (readout_reset, reset, XLXN_17239);
  bufg XLXI_5997 (.I(XLXN_18141), .O(EXT_CLK_IN));
  ibufds #(.DIFF_TERM("TRUE")) XLXI_5998 (.I(BUSA_12DP_24S), .IB(BUSA_12DN_25S), .O(XLXN_18141));
  bufg XLXI_5999 (.I(XLXN_18142), .O(PSI_CLK270));
  VERSION_BLK XLXI_4359 (.version(psi_status[63:56]));
  Ethernet_Interface XLXI_6013 (
    .MASTER_CLK(MASTER_CLK), .reset(reset), .b_data_we(b_data_we), .b_data(b_data), .tx_data(tx_data),
    .GMII_RX_DV(GMII_RX_DV_0_sig), .GMII_RX_ER(GMII_RX_ER_0_sig), .GMII_RXD(GMII_RXD_0_sig),
    .gec_user_addrs({{5{1'b0}}, gec_user_addrs}), .gec_user_dest_addrs(gec_addrs),
    .gec_user_dest_mac(gec_macport[47:0]), .gec_user_dest_port(gec_macport[63:48]), .rx_data(rx_data),
    .rx_addr(rx_addr), .rx_wren(rx_wren), .GTX_CLK(GTX_CLK_0_sig), .PHY_TX_EN(PHY_TXEN_sig),
    .PHY_TXD(PHY_TXD_sig), .PHY_TX_ER(PHY_TXER_sig));  // open: b_enable, gec_user_src_capture, gec_user_src_addrs, gec_user_src_mac, gec_user_src_port
  fd_64 XLXI_6014 (.Q(gec_macport), .CE(GEC_DEST_MACPORT_MAP), .D(rx_data), .C(MASTER_CLK), .R(reset));
  fd8re XLXI_6015 (.C(MASTER_CLK), .CE(GEC_DEST_ADDRS_MAP), .D(rx_data[7:0]), .R(reset), .Q(gec_addrs));
  ftc XLXI_4846 (.C(ADC_CLK_IN), .CLR(1'b0), .T(1'b1), .Q(XLXN_15849));
  psi_cmd_fifo32_512depth XLXI_6019 (
    .rst(psi_reset), .wr_clk(MASTER_CLK), .rd_clk(PSI_CLK0), .wr_en(PSI_CMD_FIFO_MAP),
    .rd_en(psi_cmd_fifo_re), .din(rx_data[31:0]), .full(psi_cmd_fifo_full), .empty(psi_cmd_fifo_empty),
    .dout(XLXN_16082));
  buf XLXI_6021 (psi_status[17], trigger_busy);
  obufds XLXI_6038 (.I(trigger_board_output), .O(BUSA_30DP_60S), .OB(BUSA_30DN_61S));
  obufds XLXI_6039 (.I(trigger_board_output), .O(BUSA_08DP_16S), .OB(BUSA_08DN_17S));
  calibration_controller XLXI_6042 (
    .mclk(MASTER_CLK), .trigger_busy(trigger_busy), .next_cal_trigger(EN_TRIG_TOK_MAP), .reset(trig_reset),
    .psi_cmd_fifo_empty(psi_cmd_fifo_empty), .cal_en(cal_tag_trig_num_sel), .error(psi_errors[16]),
    .cal_ctrl_psi_cmd_fifo_empty(cal_ctrl_psi_cmd_fifo_empty), .cal_ctrl_sw_en_pulse(cal_ctrl_sw_en_pulse));
  obufds XLXI_6046 (.I(EXT_TRIGG), .O(BUSD_06DP_12S), .OB(BUSD_06DN_13S));
  obufds XLXI_6047 (.I(PSI_CLK270), .O(BUSD_07DP_14S), .OB(BUSD_07DN_15S));
  ibufds #(.DIFF_TERM("FALSE")) XLXI_6040 (.I(BUSCC_06DP_12S), .IB(BUSCC_06DN_13S), .O(psi_dig_data[0]));
  ibufds #(.DIFF_TERM("FALSE")) XLXI_6051 (.I(BUSCC_07DP_14S), .IB(BUSCC_07DN_15S), .O(psi_dig_data[1]));
  m2_1 XLXI_6067 (.D0(internal_4x_clk), .D1(XLXN_18356), .S0(psi_dig_ctrl[0]), .O(XLXN_18355));
  not XLXI_6068 (XLXN_18356, internal_4x_clk);
  bufg XLXI_6072 (.I(XLXN_18355), .O(psi_dig_sdata_clk[0]));
  bufg XLXI_6083 (.I(XLXN_18354), .O(internal_4x_clk));
  buf XLXI_5683 (token[0], token[2]);
  fd8ce XLXI_6084 (.C(MASTER_CLK), .CE(PSI_DIG_MAP), .CLR(1'b0), .D(rx_data[7:0]), .Q(psi_dig_ctrl));
  m2_1 XLXI_6086 (.D0(internal_4x_clk), .D1(XLXN_18373), .S0(psi_dig_ctrl[1]), .O(XLXN_18372));
  bufg XLXI_6087 (.I(XLXN_18372), .O(psi_dig_sdata_clk[1]));
  not XLXI_6088 (XLXN_18373, internal_4x_clk);
  idelay #(.IOBDELAY_TYPE("VARIABLE")) idelay_psi_dig[1:0] (
    .I(psi_dig_data), .CE(psi_dig_data_delay_inc), .C(MASTER_CLK), .INC(1'b1), .RST(psi_dig_data_delay_rst),
    .O(psi_dig_data_delayed));
  fde chipscope_dig_latch[1:0] (.C(internal_4x_clk), .CE(1'b1), .D(psi_dig_data_delayed), .Q(psi_dig_read[1:0]));
  PSI_Dig_Block PSI_Dig_Blk[1:0] (
    .MASTER_CLK(MASTER_CLK), .rd_token_in(token[1:0]), .plaq_id(plaq_id),
    .first_in_chain(first_in_chain[1:0]), .psi_mode(b_data_mode_sel), .reset(readout_reset),
    .psi_dig_sdata_clk(psi_dig_sdata_clk), .psi_dig_data_delayed(psi_dig_data_delayed),
    .psi_token_in(psi_token_in), .psi_token_out(delayed_token), .tokin_cnt(event_number),
    .token_stack_count(token_count), .time_stamp(timestamp), .trig_cnt(trigger_number[19:0]),
    .cal_tag_trig_num_sel(cal_tag_trig_num_sel), .cal_tag(cal_tag), .bus_dout(psi_burst_data),
    .ovf_err(psi_errors[1:0]), .rd_token_out(token[2:1]), .we_out(psi_b_data_we_pre_and),
    .error_decoder_ovf(psi_errors[7:6]), .error_reset_req(psi_dig_reset_req), .sm_ready(psi_dig_sm_ready));
  or XLXI_6092 (psi_burst_we, psi_b_data_we[1], psi_b_data_we[0]);
  assign psi_b_data_we = psi_dig_ctrl[7:6] & psi_b_data_we_pre_and;  // and2 WE_DIG_AND[1..0], 2 bits wide
  assign error_reset_req = psi_dig_ctrl[3:2] & psi_dig_reset_req;  // and2 RESET_REQ_AND[1..0], 2 bits wide
  assign sm_ready = psi_dig_ctrl[5:4] | psi_dig_sm_ready;  // or2 SM_READY_OR[1..0], 2 bits wide
  fde XLXI_6032 (.C(MASTER_CLK), .CE(MASTER_TRIGGER_MAP), .D(rx_data[41]), .Q(trigger_output_mux_sel1));
  fde XLXI_6025 (.C(MASTER_CLK), .CE(MASTER_TRIGGER_MAP), .D(rx_data[40]), .Q(trigger_output_mux_sel0));
  m4_1e XLXI_6026 (
    .D0(telescope_busy), .D1(EXT_TRIGG), .D2(telescope_busy), .D3(PSI_CLK270), .E(1'b1),
    .S0(trigger_output_mux_sel0), .S1(trigger_output_mux_sel1), .O(trigger_board_output));
  fd16re XLXI_6018 (.C(MASTER_CLK), .CE(MASTER_VETO_MAP), .D(rx_data[31:16]), .R(reset), .Q(trig_veto_dur[31:16]));
  fd16re XLXI_6016 (.C(MASTER_CLK), .CE(MASTER_VETO_MAP), .D(rx_data[15:0]), .R(reset), .Q(trig_veto_dur[15:0]));
  fde XLXI_6009 (.C(MASTER_CLK), .CE(MASTER_TRIGGER_MAP), .D(rx_data[36]), .Q(trig_mask_hi));
  fde XLXI_6008 (.C(MASTER_CLK), .CE(MASTER_TRIGGER_MAP), .D(rx_data[32]), .Q(trig_mask_en));
  trigger_fifo_8 XLXI_5983 (
    .clk(PSI_CLK270), .rst(XLXN_18128), .wr_en(trig_fifo_we), .rd_en(trig_fifo_re), .din(trig_fifo_ts),
    .empty(trig_fifo_empty), .dout(trig_fifo_read));  // open: full
  or XLXI_5988 (XLXN_18128, trigger_throttle, reset);
  or XLXI_5986 (scin_phys_gated[2], 1'b0, XLXN_18001);
  or XLXI_5985 (scin_phys_gated[1], 1'b0, XLXN_18000);
  or XLXI_5984 (scin_phys_gated[0], scin_phys[0], XLXN_17999);
  or XLXI_5839 (telescope_busy, trigger_throttle, XLXN_17722);
  TriggerBlock XLXI_5836 (
    .mclk(MASTER_CLK), .xclk(PSI_CLK270), .rst(reset), .en(telescope_trigger_en), .we(MASTER_TRIGGER_MAP),
    .trig_fifo_empty(trig_fifo_empty), .trig_mask_en(trig_mask_en), .trig_mask_hi(trig_mask_hi),
    .scin(scin_phys_gated), .master_clk_delay(rx_data[19:16]), .psi_clk_delay(rx_data[27:20]),
    .trig_fifo_read(trig_fifo_read), .trig_fifo_we(trig_fifo_we), .trig_fifo_re(trig_fifo_re),
    .busy(XLXN_17722), .trig_out(EXT_TRIGG), .trig_fifo_ts(trig_fifo_ts), .veto_duration(trig_veto_dur[19:0]));
  or XLXI_5978 (trig_throttle_ms, token_throttle[1], token_throttle[0]);
  fde XLXI_5894 (.C(MASTER_CLK), .CE(MASTER_TRIGGER_MAP), .D(rx_data[4]), .Q(XLXN_17999));
  fde XLXI_5896 (.C(MASTER_CLK), .CE(MASTER_TRIGGER_MAP), .D(rx_data[6]), .Q(XLXN_18001));
  fde XLXI_5895 (.C(MASTER_CLK), .CE(MASTER_TRIGGER_MAP), .D(rx_data[5]), .Q(XLXN_18000));
  and XLXI_5902 (trig_throttle_gated[2], 1'b0, XLXN_17915);
  and XLXI_5901 (trig_throttle_gated[1], trig_throttle_ms, XLXN_17914);
  and XLXI_5900 (trig_throttle_gated[0], 1'b0, XLXN_17913);
  fde XLXI_5891 (.C(MASTER_CLK), .CE(MASTER_TRIGGER_MAP), .D(rx_data[8]), .Q(XLXN_17913));
  fde XLXI_5893 (.C(MASTER_CLK), .CE(MASTER_TRIGGER_MAP), .D(rx_data[10]), .Q(XLXN_17915));
  fde XLXI_5892 (.C(MASTER_CLK), .CE(MASTER_TRIGGER_MAP), .D(rx_data[9]), .Q(XLXN_17914));
  and XLXI_5884 (telescope_trigger_en, ~trigger_throttle, XLXN_17849);  // and2b1
  or XLXI_5838 (trigger_throttle, trig_throttle_gated[2], trig_throttle_gated[1], trig_throttle_gated[0]);
  fde XLXI_5873 (.C(MASTER_CLK), .CE(MASTER_TRIGGER_MAP), .D(rx_data[0]), .Q(XLXN_17849));

  // Notes on the sheet:
  //   GEC_CONTROLLER
  //   RESET MANAGER
  //   GEC_IO
  //   MASTER_CLK is GMII_RX_CLK
  //   Dont use D4!.. In use by master for trigger. Avoid accidental tampering.
  //   READ MUX
  //   0 - is Plaq0, 1 - is Plaq1, 2 - is Plaq2, 3 - is Plaq3
  //   0 - is ADC mode, 1 - is PSI mode
  //   Bits 3,4 select PSI decoder debug mode. 00 is normal pixel data mode.
  //   The TriggerBlock busy signal should OR'd with the TokenStack throttle signals from all CAPTAN stations
  //   PSI CONTROLLER
  //   CLK and PSI RESETS
  //   FOR INPUT DELAY LINES
  //   CLOCK GENERATION
  //   Foundation I/O
  //   ADC I/O
  //   PSI46 I/O - Plaquette 0
  //   PSI46 I/O - Plaquette 2
  //   ADC Test Mode Signal
  //   PSI46 I/O - Plaquette 1
  //   PSI46 I/O - Plaquette 3
  //   SATA Connector J63 (below J60) on left
  //   Digital PSI Serial Data
  //   CSIB J3 connects to GreenV2 J2 (Bus C)
  //   EXTERNAL TRIGGER AND CLOCK OUTPUT
  //   INPUT FROM SCINTILLATORS AND ACCELERATOR CLOCK
  //   SATA Connector J57 on right
  //   Upstream
  //   SATA Connector J60 on left
  //   Downstream
  //   SATA Connector J56 (below J57)
  //   Strips
  //   CSIB J3 connects to GreenV2 J2 (Bus C)
  //   RECEIVE THROTTLE FROM SLAVES ON SATA
  //   To LEMO J1
  //   (could be) SATA Connector J56 (below J57 on right) - Ch A
  //   (could be) SATA Connector J63 (below J60 on left) - Ch A
endmodule
